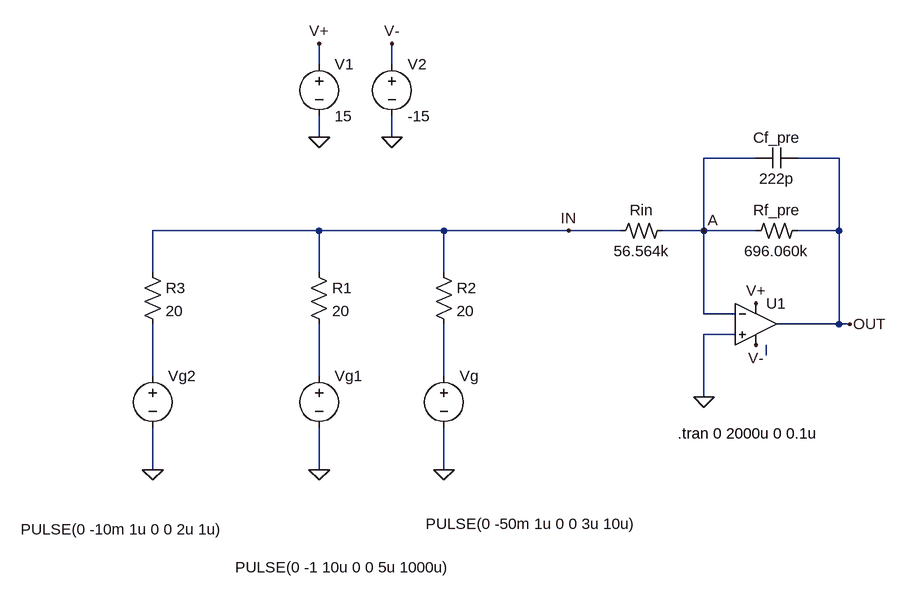
[diagram p0: schematic PreAmp.asc]
PreAmp.asc, the LTspice schematic file:
Version 4
SHEET 1 880 680
WIRE -272 -304 -272 -336
WIRE -160 -304 -160 -336
WIRE -272 -192 -272 -224
WIRE -160 -192 -160 -224
WIRE 400 -160 320 -160
WIRE 528 -160 464 -160
WIRE -272 -48 -528 -48
WIRE -80 -48 -272 -48
WIRE 112 -48 -80 -48
WIRE 192 -48 112 -48
WIRE 320 -48 320 -160
WIRE 320 -48 256 -48
WIRE 400 -48 320 -48
WIRE 528 -48 528 -160
WIRE 528 -48 464 -48
WIRE -528 16 -528 -48
WIRE -272 16 -272 -48
WIRE -80 16 -80 -48
WIRE 320 80 320 -48
WIRE 368 80 320 80
WIRE 528 96 528 -48
WIRE 528 96 432 96
WIRE 544 96 528 96
WIRE 368 112 320 112
WIRE 416 144 416 128
WIRE -528 176 -528 96
WIRE -272 176 -272 96
WIRE -80 176 -80 96
WIRE 320 208 320 112
WIRE -528 320 -528 256
WIRE -272 320 -272 256
WIRE -80 320 -80 256
FLAG -272 -192 0
FLAG -160 -192 0
FLAG -272 -336 V+
FLAG -160 -336 V-
FLAG 320 208 0
FLAG 544 96 OUT
FLAG 112 -48 IN
FLAG 400 128 V-
FLAG 400 64 V+
FLAG -80 320 0
FLAG 320 -48 A
FLAG -272 320 0
FLAG -528 320 0
SYMBOL voltage -272 -320 R0
WINDOW 123 24 126 Left 2
WINDOW 39 24 111 Left 2
SYMATTR InstName V1
SYMATTR Value 15
SYMBOL voltage -160 -320 R0
WINDOW 123 24 126 Left 2
WINDOW 39 24 111 Left 2
SYMATTR InstName V2
SYMATTR Value -15
SYMBOL Opamps/UniversalOpamp2 400 96 R0
SYMATTR InstName U1
SYMBOL res2 256 -64 R90
WINDOW 0 0 32 VBottom 2
WINDOW 3 32 32 VTop 2
SYMATTR InstName Rin
SYMATTR Value 56.564k
SYMBOL res2 464 -64 R90
WINDOW 0 0 32 VBottom 2
WINDOW 3 32 32 VTop 2
SYMATTR InstName Rf_pre
SYMATTR Value 696.060k
SYMBOL voltage -80 160 R0
WINDOW 3 -28 243 Left 2
WINDOW 123 0 0 Left 0
WINDOW 39 0 0 Left 0
SYMATTR Value PULSE(0 -50m 1u 0 0 3u 10u)
SYMATTR InstName Vg
SYMBOL cap 464 -176 R90
WINDOW 0 0 32 VBottom 2
WINDOW 3 32 32 VTop 2
SYMATTR InstName Cf_pre
SYMATTR Value 222p
SYMBOL voltage -272 160 R0
WINDOW 3 -129 310 Left 2
WINDOW 123 0 0 Left 0
WINDOW 39 0 0 Left 0
SYMATTR Value PULSE(0 -1 10u 0 0 5u 1000u)
SYMATTR InstName Vg1
SYMBOL res -288 0 R0
SYMATTR InstName R1
SYMATTR Value 20
SYMBOL res -96 0 R0
SYMATTR InstName R2
SYMATTR Value 20
SYMBOL voltage -528 160 R0
WINDOW 3 -203 252 Left 2
WINDOW 123 0 0 Left 0
WINDOW 39 0 0 Left 0
SYMATTR Value PULSE(0 -10m 1u 0 0 2u 1u)
SYMATTR InstName Vg2
SYMBOL res -544 0 R0
SYMATTR InstName R3
SYMATTR Value 20
TEXT 280 264 Left 2 !.tran 0 2000u 0 0.1u

The netlist it stands for:
* PreAmp.asc
V1 V+ 0 15
V2 V- 0 -15
XU1 0 A V+ V- OUT level.2 Avol=1Meg GBW=10Meg Slew=10Meg ilimit=25m rail=0 Vos=0 phimargin=45 en=0 enk=0 in=0 ink=0 Rin=500Meg  ; pins IN+ IN- V+ V- OUT
Rin A IN 56.564k
Rf_pre OUT A 696.060k
Vg N004 0 PULSE(0 -50m 1u 0 0 3u 10u)
Cf_pre OUT A 222p
Vg1 N003 0 PULSE(0 -1 10u 0 0 5u 1000u)
R1 IN N003 20
R2 IN N004 20
Vg2 N002 0 PULSE(0 -10m 1u 0 0 2u 1u)
R3 IN N002 20
.tran 0 2000u 0 0.1u
.lib UniversalOpamps2.sub
.backanno
.end

* Results of the author's LTspice run, read from the files saved beside the schematic
* Operating Point, zero values left out:
*   V(v+) = 15 V
*   V(v-) = -15 V
*   I(V2) = 1.498 mA
*   I(V1) = -1.498 mA
*   Ix(u1:3) = 1.498 mA
*   Ix(u1:4) = -1.498 mA
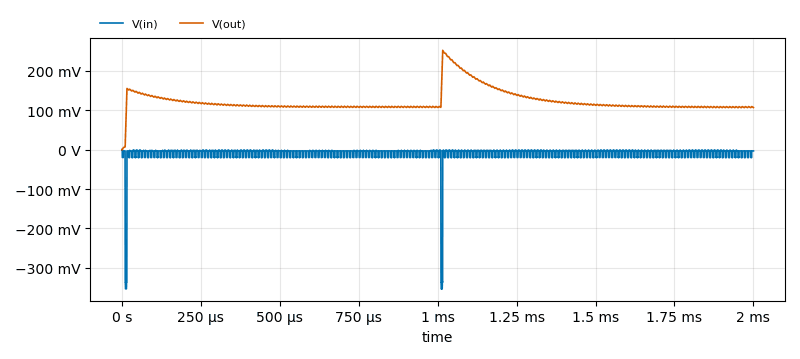
[diagram p1: Transient Analysis of PreAmp.asc, plotted from the saved traces]
* Transient Analysis, 1 run:
*   V(in): min -353.3 mV, max 0 V, average -10.59 mV, rms 27.98 mV, last -3.333 mV
*   V(out): min -52.71 nV, max 251.9 mV, average 121.9 mV, rms 125 mV, last 106.9 mV